# Altium project PCB_RGBcontroller.PrjPCB
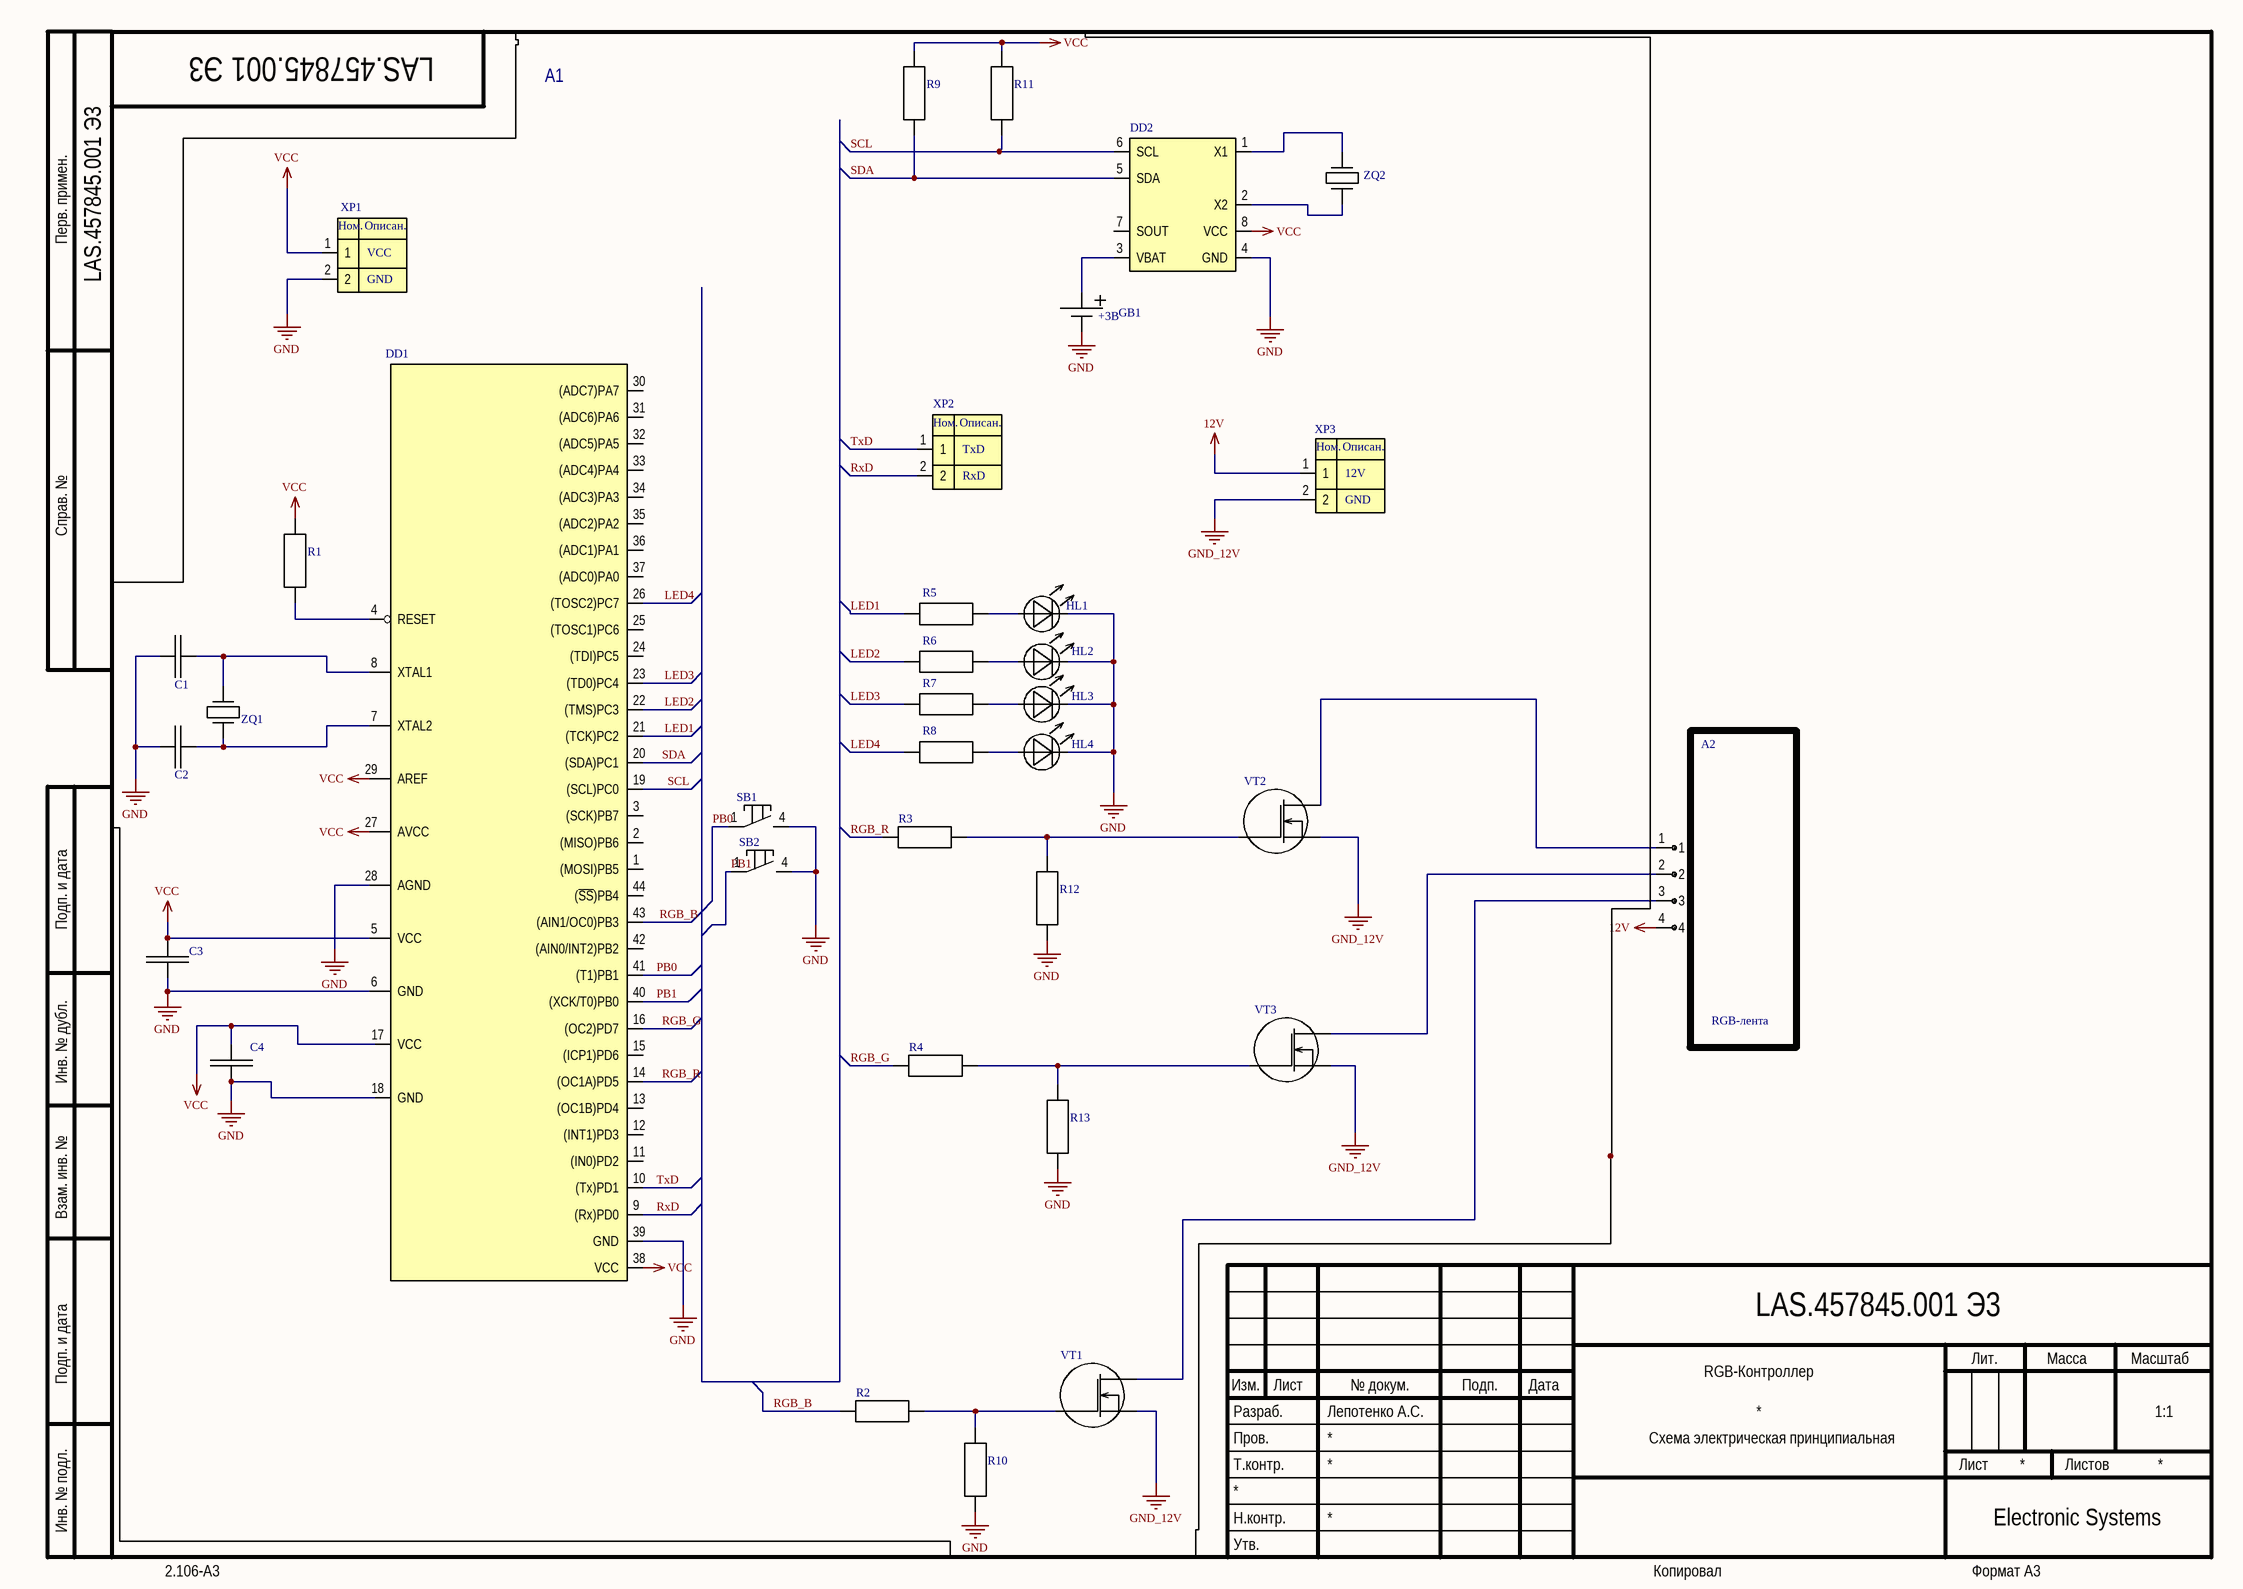
[diagram p0: circuit.SchDoc]
1 sheet, 35 parts. Net scope: global (net labels, ports and power ports of the same name join across sheets).
Board file: PCB181216ver1.PcbDoc

## Sheet circuit.SchDoc: RGB-Контроллер
size 420 x 297 mm; Author: Лепотенко А.С.; CompanyName: Electronic Systems; Organization: Electronic Systems; DocumentNumber: LAS.457845.001 Э3; Scale: 1:1; DocumentType: Схема электрическая принципиальная; FirstReferrence: LAS.457845.001 Э3; DocumentName: Контроллер RGB

### Parts
C1  Capasitor  [CAPC3216L]  (value not drawn)
C2  Capasitor  [CAPC3216L]  (value not drawn)
C3  Capasitor  [CAPC3216L]  (value not drawn)
C4  Capasitor  [CAPC3216L]  (value not drawn)
DD1  ATMega 16  [44A_M]  (value not drawn)
DD2  ds1307  [SOIC127P600X135-8N]  (value not drawn)
GB1  Battery  [battery]  (value not drawn)
HL1  LED  [GNLR]  (value not drawn)
HL2  LED  [GNLR]  (value not drawn)
HL3  LED  [GNLR]  (value not drawn)
HL4  LED  [GNLR]  (value not drawn)
R1  Resistor  [RESC3216M]  (value not drawn)
R2  Resistor  [RESC3216M]  (value not drawn)
R3  Resistor  [RESC3216M]  (value not drawn)
R4  Resistor  [RESC3216M]  (value not drawn)
R5  Resistor  [RESC3216M]  (value not drawn)
R6  Resistor  [RESC3216M]  (value not drawn)
R7  Resistor  [RESC3216M]  (value not drawn)
R8  Resistor  [RESC3216M]  (value not drawn)
R9  Resistor  [RESC3216M]  (value not drawn)
R10  Resistor  [RESC3216M]  (value not drawn)
R11  Resistor  [RESC3216M]  (value not drawn)
R12  Resistor  [RESC3216M]  (value not drawn)
R13  Resistor  [RESC3216M]  (value not drawn)
RGB_Controller1  RGB_Lent  [RGB]  (value not drawn)
SB1  button  [1102WD / 6x6x9,5 smd (T218)  технические характеристики скачать документацию (datasheet) по IT-1102WD / 6x6x9,5 smd]  (value not drawn)
SB2  button  [1102WD / 6x6x9,5 smd (T218)  технические характеристики скачать документацию (datasheet) по IT-1102WD / 6x6x9,5 smd]  (value not drawn)
VT1  IRZF44N  [TO-220]  (value not drawn)
VT2  IRZF44N  [TO-220]  (value not drawn)
VT3  IRZF44N  [TO-220]  (value not drawn)
XP1  Power Connector  [HB-2.0]  (value not drawn)
XP2  USART_connector  [pls-02]  (value not drawn)
XP3  Power 12V  [HB-2.0]  (value not drawn)
ZQ1  Rezanator8M  [HC-49US]  (value not drawn)
ZQ2  Rezanator  [BCY-W2/D2.1]  (value not drawn)

### Nets
12V: RGB_Controller1.4 XP3.1
GND: C1.1 C2.1 C3.1 C4.1 DD1.6(GND) DD1.18(GND) DD1.28(AGND) DD1.39(GND) DD2.4(GND) GB1.2 HL1.2 HL2.2 HL3.2 HL4.2 R10.1 R12.1 R13.1 SB1.4 SB2.4 XP1.2
GND_12V: VT1.3(Source) VT2.3(Source) VT3.3(Source) XP3.2
VCC: C3.2 C4.2 DD1.5(VCC) DD1.17(VCC) DD1.27(AVCC) DD1.29(AREF) DD1.38(VCC) DD2.8(VCC) R1.2 R9.2 R11.2 XP1.1
LED1: DD1.21((TCK)PC2) R5.1
LED2: DD1.22((TMS)PC3) R6.1
LED3: DD1.23((TD0)PC4) R7.1
LED4: DD1.26((TOSC2)PC7) R8.1
PB0: DD1.41((T1)PB1) SB1.1
PB1: DD1.40((XCK/T0)PB0) SB2.1
RGB_B: DD1.43((AIN1/OC0)PB3) R2.1
RGB_G: DD1.16((OC2)PD7) R4.1
RGB_R: DD1.14((OC1A)PD5) R3.1
RxD: DD1.9((Rx)PD0) XP2.2
SCL: DD1.19((SCL)PC0) DD2.6(SCL) R11.1
SDA: DD1.20((SDA)PC1) DD2.5(SDA) R9.1
TxD: DD1.10((Tx)PD1) XP2.1
NetC1_2: C1.2 DD1.8(XTAL1) ZQ1.1
NetC2_2: C2.2 DD1.7(XTAL2) ZQ1.2
NetDD1_4: DD1.4(RESET) R1.1
NetDD2_1: DD2.1(X1) ZQ2.2
NetDD2_2: DD2.2(X2) ZQ2.1
NetDD2_3: DD2.3(VBAT) GB1.1
NetHL1_1: HL1.1 R5.2
NetHL2_1: HL2.1 R6.2
NetHL3_1: HL3.1 R7.2
NetHL4_1: HL4.1 R8.2
NetR2_2: R2.2 R10.2 VT1.1(G)
NetR3_2: R3.2 R12.2 VT2.1(G)
NetR4_2: R4.2 R13.2 VT3.1(G)
NetRGB_Controller1_1: RGB_Controller1.1 VT2.2(D)
NetRGB_Controller1_2: RGB_Controller1.2 VT3.2(D)
NetRGB_Controller1_3: RGB_Controller1.3 VT1.2(D)

Not connected (* = marked no-connect by the designer): DD1 1((MOSI)PB5) 2((MISO)PB6) 3((SCK)PB7) 11((IN0)PD2) 12((INT1)PD3) 13((OC1B)PD4) 15((ICP1)PD6) 24((TDI)PC5) 25((TOSC1)PC6) 30((ADC7)PA7) 31((ADC6)PA6) 32((ADC5)PA5) 33((ADC4)PA4) 34((ADC3)PA3) 35((ADC2)PA2) 36((ADC1)PA1) 37((ADC0)PA0) 42((AIN0/INT2)PB2) 44((~{SS})PB4); DD2 7(SOUT)

### Notes on the sheet
- A1
- A2
- RGB-лента
- Перв. примен.
- Справ. №
- Подп. и дата
- Инв. № дубл.
- Взам. инв. №
- Разраб.
- Изм.
- Лист
- № докум.
- Подп.
- Дата
- Лит.
- Масса
- Масштаб
- Пров.
- Т.контр.
- Листов
- Инв. № подл.
- Утв.
- Н.контр.
- 2.106-A3
- Копировал
- Формат А3
- (in symbol Battery) +3В
- (in symbol Power 12V) Ном.; Описан.; 12V; GND
- (in symbol Power Connector) Ном.; Описан.; VCC; GND
- (in symbol USART_connector) Ном.; Описан.; TxD; RxD